# EAGLE design 8x8 led matrix DRIVER (EAGLE 7.5.0)
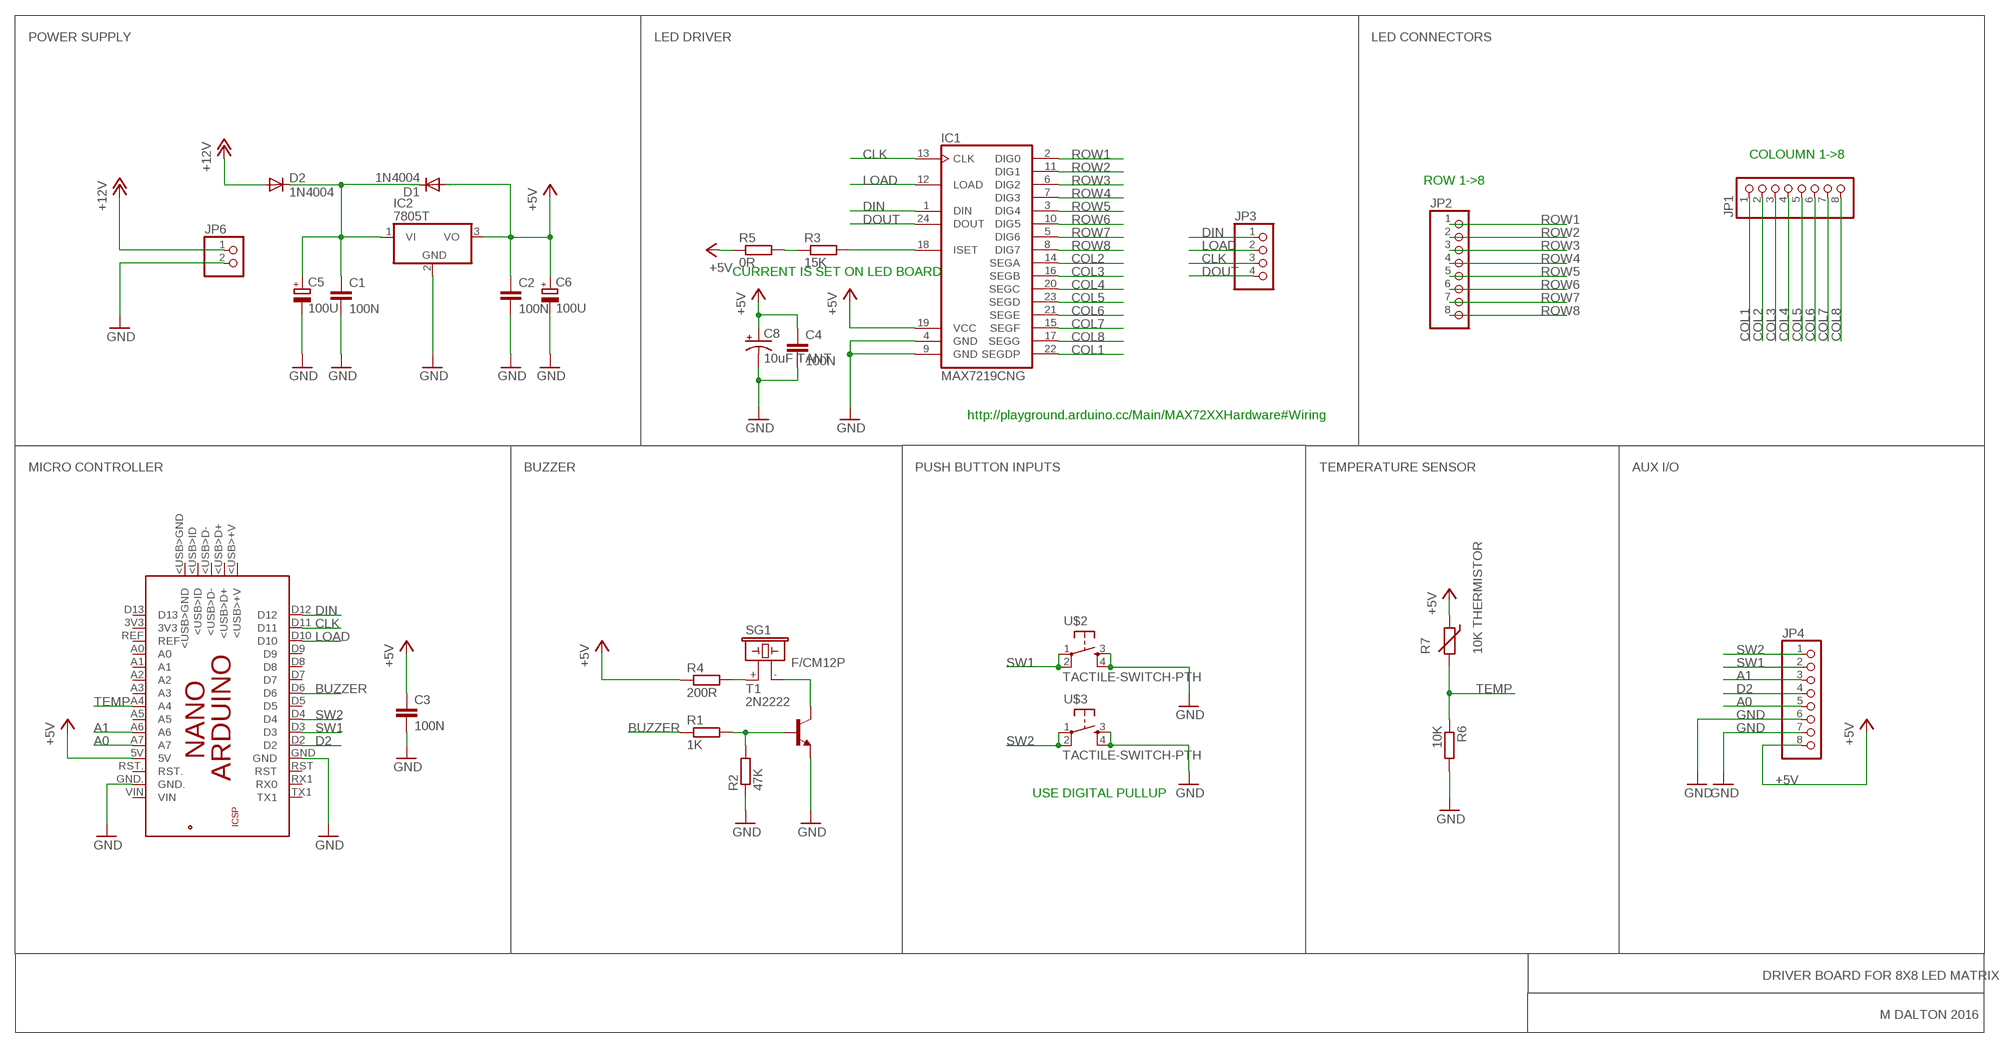
[diagram p0: schematic, sheet 1]

## Parts
C1  100N  C-EUC1206K  [C1206K]
C2  100N  C-EUC1206K  [C1206K]
C3  100N  C-EUC1206K  [C1206K]
C4  100N  C-EUC1206K  [C1206K]
C5  100U  CPOL-EUE5-10.5  [E5-10,5]
C6  100U  CPOL-EUE5-10.5  [E5-10,5]
C8  10uF TANT  10UF-TANT  [EIA3216]
D1  1N4004  [DO41-10]
D2  1N4004  [DO41-10]
IC1  MAX7219CNG  [DIL24-3]
IC2  7805T  [TO220H]
JP1  PINHD-1X8  [1X08]
JP2  PINHD-1X8  [1X08]
JP3  PINHD-1X4  [1X04]
JP4  PINHD-1X8  [1X08]
JP6  PINHD-1X2  [1X02]
PCB1  ARDUINO_NANO  [ARDUINO_NANO]
R1  1K  R-EU_M1206  [M1206]
R2  47K  R-EU_M1206  [M1206]
R3  15K  R-EU_M0805  [M0805]
R4  200R  R-EU_M1206  [M1206]
R5  0R  R-EU_M0805  [M0805]
R6  10K  R-EU_M1206  [M1206]
R7  10K THERMISTOR  THERMISTOR-7,5  [R-7,5]
SG1  F/CM12P  [F/CM12P]
T1  2N2222  [TO92-EBC-OVAL]
U$2  TACTILE-SWITCH-PTH  [TAC-SWITCH-PTH]
U$3  TACTILE-SWITCH-PTH  [TAC-SWITCH-PTH]

## Nets
+5V: C2.1 C3.1 C4.1 C6.+ C8.A(+) D1.A IC1.19(VCC) IC2.3(VO) JP4.8 PCB1.5V R4.1 R5.1 R7.1
+12V: D2.A JP6.1
A0: JP4.5 PCB1.A7
A1: JP4.3 PCB1.A6
BUZZER: PCB1.D6 R1.1
CLK: IC1.13(CLK) JP3.3 PCB1.D11
COL1: IC1.22(SEGDP) JP1.1
COL2: IC1.14(SEGA) JP1.2
COL3: IC1.16(SEGB) JP1.3
COL4: IC1.20(SEGC) JP1.4
COL5: IC1.23(SEGD) JP1.5
COL6: IC1.21(SEGE) JP1.6
COL7: IC1.15(SEGF) JP1.7
COL8: IC1.17(SEGG) JP1.8
D2: JP4.4 PCB1.D2
DIN: IC1.1(DIN) JP3.1 PCB1.D12
DOUT: IC1.24(DOUT) JP3.4
GND: C1.2 C2.2 C3.2 C4.2 C5.- C6.- C8.C(-) IC1.4(GND) IC1.9(GND) IC2.2(GND) JP4.6 JP4.7 JP6.2 PCB1.GND PCB1.GND. R2.1 R6.2 T1.E U$2.3 U$2.4 U$3.3 U$3.4
LOAD: IC1.12(LOAD) JP3.2 PCB1.D10
N$1: R3.1 R5.2
N$8: C1.1 C5.+ D1.C D2.C IC2.1(VI)
N$22: IC1.18(ISET) R3.2
N$27: R1.2 R2.2 T1.B
N$29: SG1.- T1.C
N$30: R4.2 SG1.+
ROW1: IC1.2(DIG0) JP2.1
ROW2: IC1.11(DIG1) JP2.2
ROW3: IC1.6(DIG2) JP2.3
ROW4: IC1.7(DIG3) JP2.4
ROW5: IC1.3(DIG4) JP2.5
ROW6: IC1.10(DIG5) JP2.6
ROW7: IC1.5(DIG6) JP2.7
ROW8: IC1.8(DIG7) JP2.8
SW1: JP4.2 PCB1.D3 U$2.1 U$2.2
SW2: JP4.1 PCB1.D4 U$3.1 U$3.2
TEMP: PCB1.A4 R6.1 R7.2
Unconnected: PCB1.3V3 PCB1.5V. PCB1.<USB>+V PCB1.<USB>D+ PCB1.<USB>D- PCB1.<USB>GND PCB1.<USB>ID PCB1.A0 PCB1.A1 PCB1.A2 PCB1.A3 PCB1.A5 PCB1.D5 PCB1.D7 PCB1.D8 PCB1.D9 PCB1.D13 PCB1.GND_ PCB1.MISO PCB1.MOSI PCB1.REF PCB1.RESET.. PCB1.RST PCB1.RST. PCB1.RX1(RX0) PCB1.SCK PCB1.TX1 PCB1.VIN

## Notes on the sheet
- POWER SUPPLY | LED DRIVER | LED CONNECTORS
- COLOUMN 1->8
- ROW 1->8
- CURRENT IS SET ON LED BOARD
- http://playground.arduino.cc/Main/MAX72XXHardware#Wiring
- MICRO CONTROLLER | BUZZER | PUSH BUTTON INPUTS | TEMPERATURE SENSOR | AUX I/O
- USE DIGITAL PULLUP
- DRIVER BOARD FOR 8X8 LED MATRIX
- M DALTON 2016

## Library data of the parts
C1-C4 = rcl:C-EU: CAPACITOR, European symbol
C5 C6 = rcl:CPOL-EU: POLARIZED CAPACITOR, European symbol
C8 = SparkFun-Retired:10UF-TANT: 10uF Tantalum SMT CAP-00811- 16V 10% (EIA-3216); PROD_ID: CAP-00811; VALUE: 10uF
D1 = diode:1N4004: DIODE
D2 = adafruit:1N4004: DIODE
IC1 = maxim:MAX7219CNG: LED DISPLAY DRIVER; MF: MAXIM; MPN: MAX7219CNG; OC_FARNELL: 1523914; OC_NEWARK: 34C4018
IC2 = adafruit:78*: Positive VOLTAGE REGULATOR Added bigger pads to the TO-92 package
JP1 JP2 JP4 = pinhead:PINHD-1X8: PIN HEADER
JP3 = pinhead:PINHD-1X4: PIN HEADER
JP6 = pinhead:PINHD-1X2: PIN HEADER
PCB1 = E14_Arduino_published:ARDUINO_NANO: Device for representing an Arduino Nano board with a footprint in an EAGLE design. Created by Dave Young for Element14. More EAGLE documentation at: http://www.element14.com/community/community/knode/cadsoft_eagle
R1-R6 = rcl:R-EU_: RESISTOR, European symbol
R7 = varistor:THERMISTOR: THERMISTOR
SG1 = buzzer:F/CM12P: BUZZER Source: Buerklin; OC_FARNELL: unknown; OC_NEWARK: unknown
T1 = adafruit:2N2222: NPN TRANSISTOR Big oval pads
U$2 U$3 = GeekAmmo:TACTILE-SWITCH: Tactile Switch 4 Pins, SPST NO

## Board
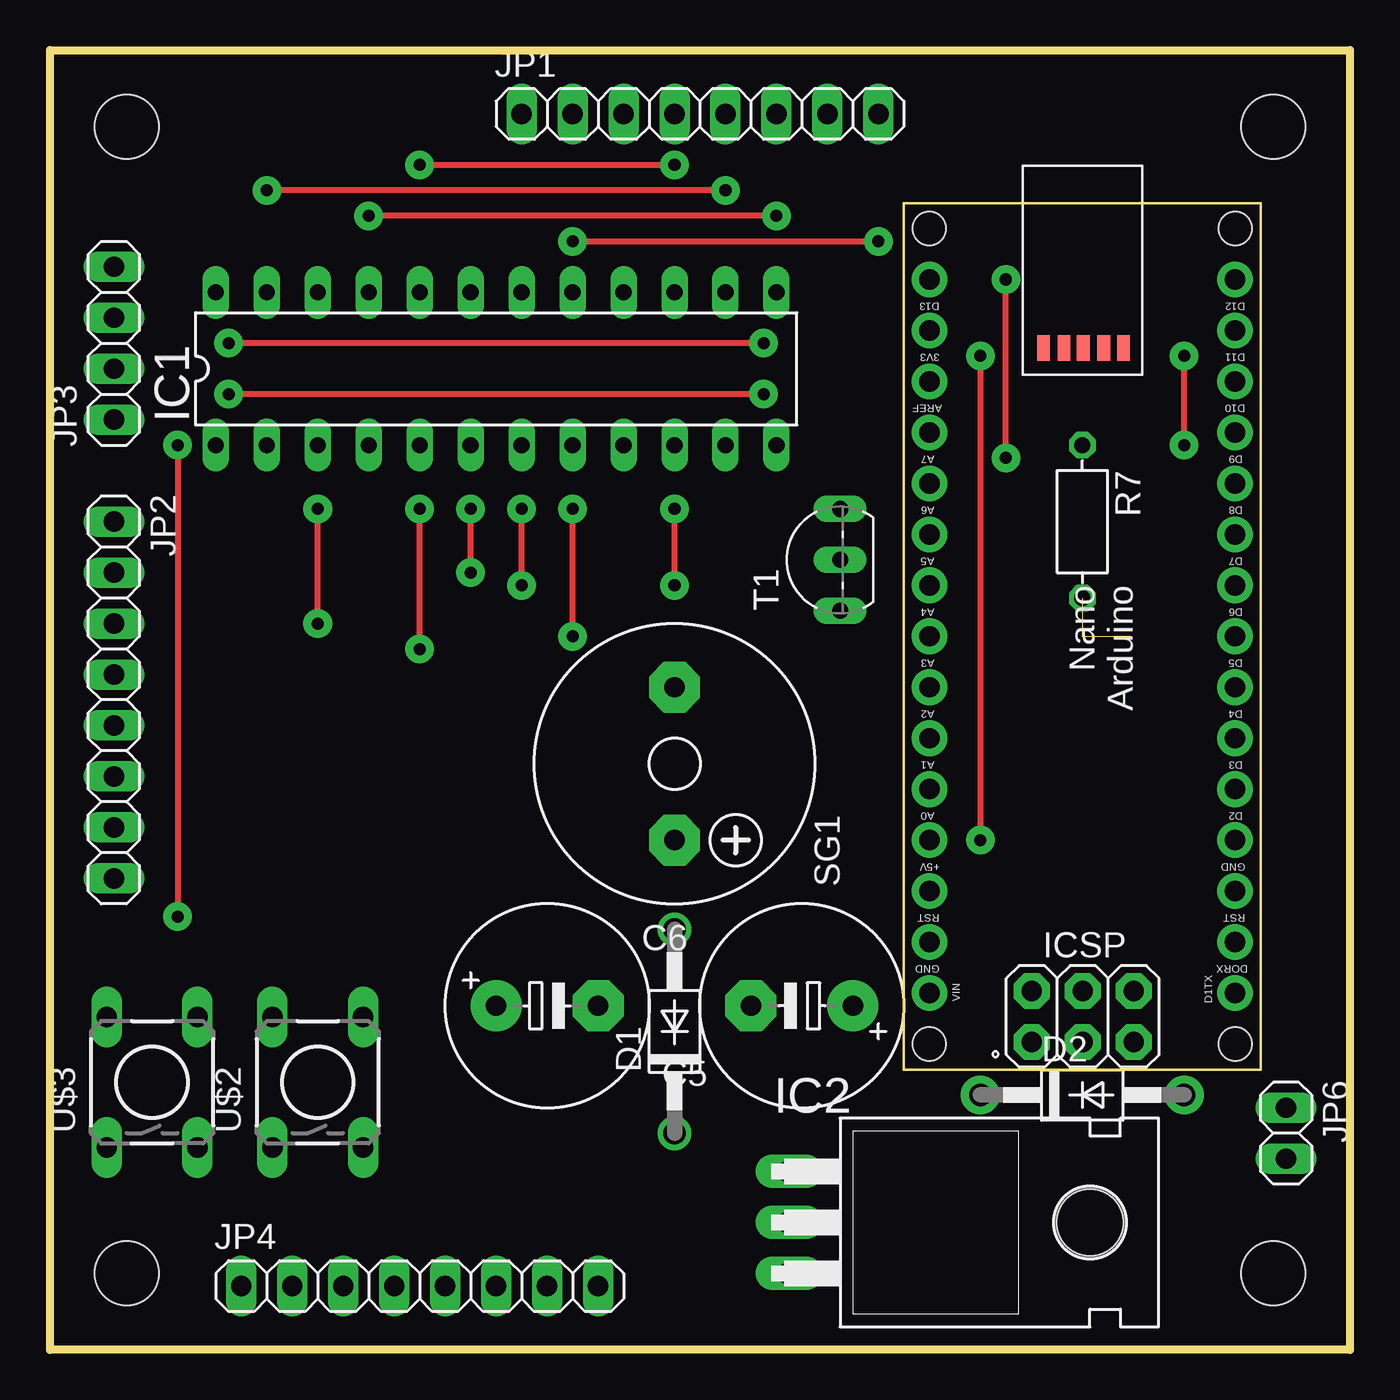
[diagram p1: board, top side]
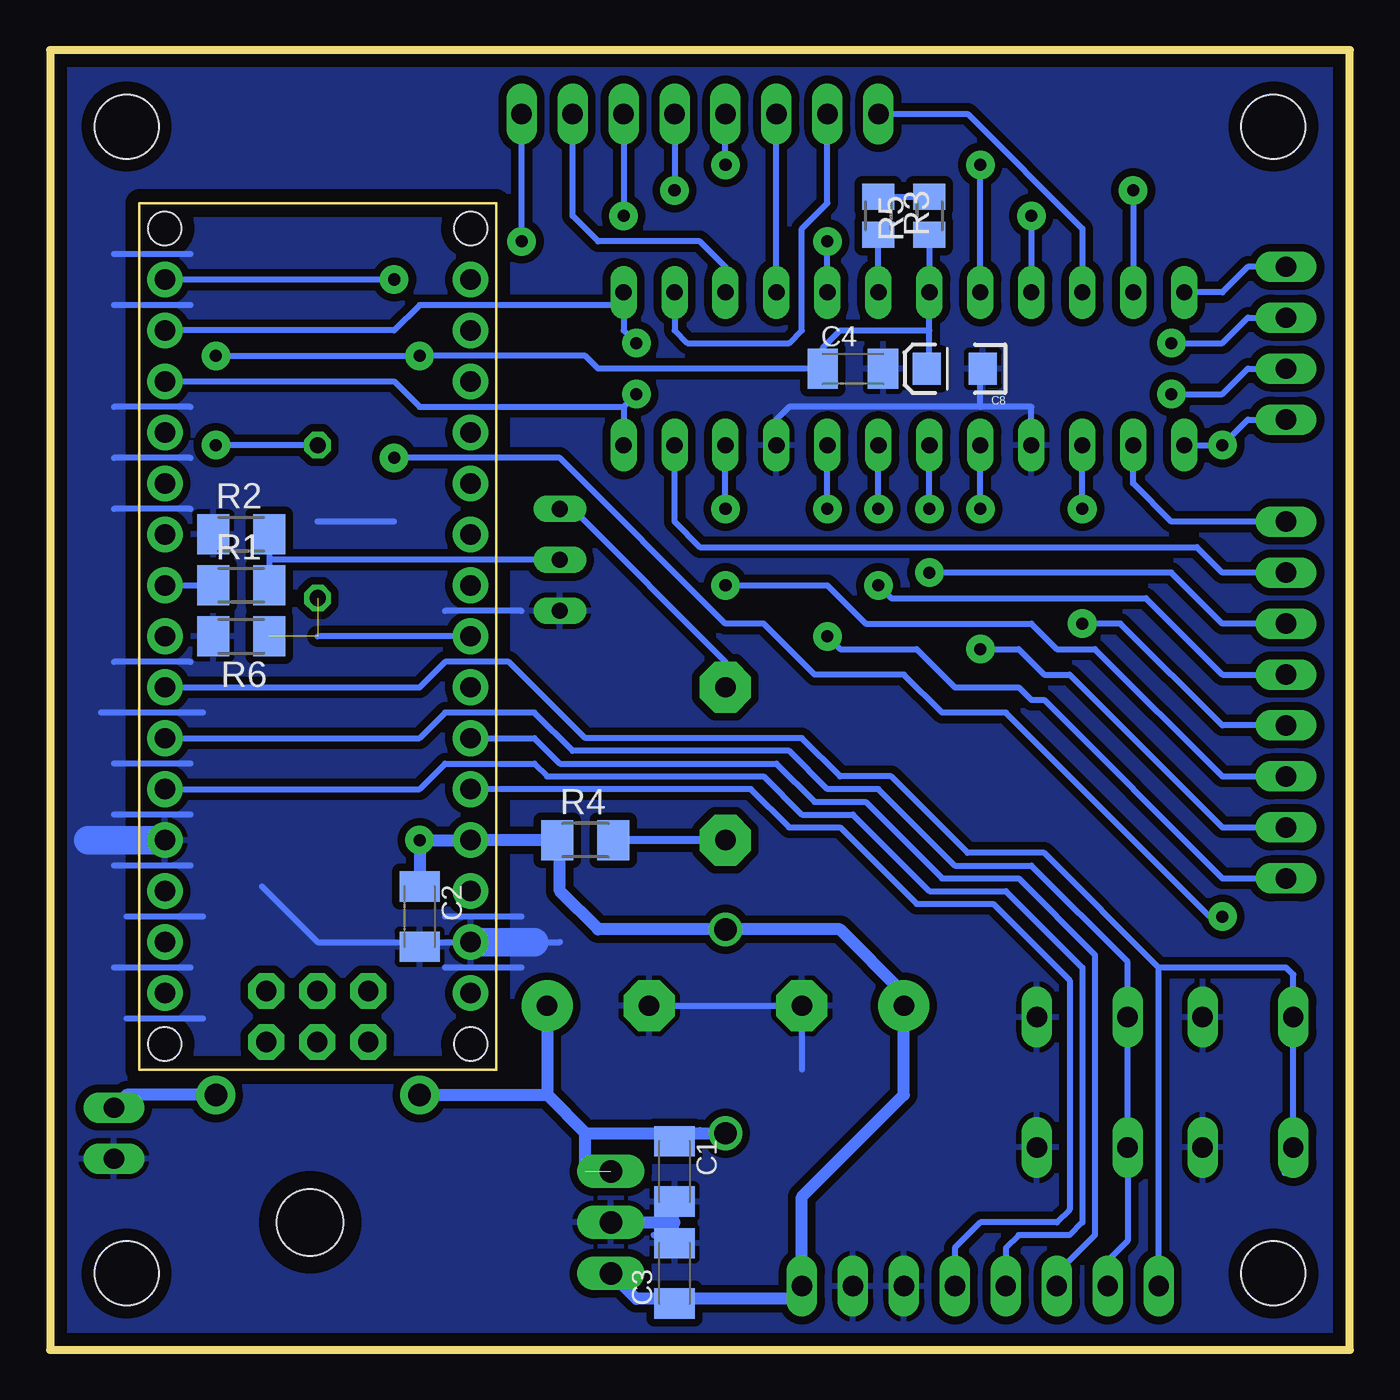
[diagram p2: board, bottom side, seen from below]

Size 64.77 x 64.77 mm. Coordinates in mm from the lower left corner, seen from the top.
Outline: 64.77,0 0,0 0,64.77 64.77,64.77 64.77,0
Copper layers (1*16): Top 0.035mm / dielectric 1.5mm / Bottom 0.035mm
Design rules "default *": minimum track width 10mil, minimum drill 24mil, track to track 15mil, track to pad 15mil, pad to pad 15mil, via to via 15mil, smd to smd 15mil, copper to edge 25mil, drill to drill 10mil, minimum pad ring 10mil, minimum via ring 8mil, stop-mask expansion 4mil, vias tented up to drill 0mil, thermal gap 10mil
Holes 3.2 mm at 3.81,3.81 60.96,3.81 3.81,60.96 60.96,60.96

### Footprints (pad centres in the part's own frame; a part is rotated, then mirrored left to right if it is on the bottom)
C1206K = smd 1.5 x 2: 1 -1.5,0; 2 1.5,0
E5-10,5 = drill 1.016 pad 2.54: + -2.54,0 | drill 1.016 pad 2.54 octagon: - 2.54,0
EIA3216 = smd 1.4 x 1.6: A 1.4,0; C -1.4,0
DO41-10 = drill 1.118: A 5.08,0; C -5.08,0
DO41-10' = drill 1.118 pad 1.93: A 5.08,0; C -5.08,0
DIL24-3 = drill 0.813 long: 1 -13.97,-3.81; 2 -11.43,-3.81; 3 -8.89,-3.81; 4 -6.35,-3.81; 5 -3.81,-3.81; 6 -1.27,-3.81; 7 1.27,-3.81; 8 3.81,-3.81; 9 6.35,-3.81; 10 8.89,-3.81; 11 11.43,-3.81; 12 13.97,-3.81; 13 13.97,3.81; 14 11.43,3.81; 15 8.89,3.81; 16 6.35,3.81; 17 3.81,3.81; 18 1.27,3.81; 19 -1.27,3.81; 20 -3.81,3.81; 21 -6.35,3.81; 22 -8.89,3.81; 23 -11.43,3.81; 24 -13.97,3.81
TO220H = drill 1.118 long: 1 -2.54,-10.16; 2 0,-10.16; 3 2.54,-10.16 | hole 3.302: 0,4.826
1X08 = drill 1.016 long: 1 -8.89,0; 2 -6.35,0; 3 -3.81,0; 4 -1.27,0; 5 1.27,0; 6 3.81,0; 7 6.35,0; 8 8.89,0
1X04 = drill 1.016 long: 1 -3.81,0; 2 -1.27,0; 3 1.27,0; 4 3.81,0
1X02 = drill 1.016 long: 1 -1.27,0; 2 1.27,0
ARDUINO_NANO = drill 1.016 pad 1.778: 3V3 6.35,1.27; 5V 31.75,1.27; A0 11.43,1.27; A1 13.97,1.27; A2 16.51,1.27; A3 19.05,1.27; A4 21.59,1.27; A5 24.13,1.27; A6 26.67,1.27; A7 29.21,1.27; D2 29.21,16.51; D3 26.67,16.51; D4 24.13,16.51; D5 21.59,16.51; D6 19.05,16.51; D7 16.51,16.51; D8 13.97,16.51; D9 11.43,16.51; D10 8.89,16.51; D11 6.35,16.51; D12 3.81,16.51; D13 3.81,1.27; GND 31.75,16.51; GND. 36.83,1.27; REF 8.89,1.27; RST 34.29,16.51; RST. 34.29,1.27; RX1 36.83,16.51; TX1 39.37,16.51; VIN 39.37,1.27 | drill 1.016 pad 1.778 octagon: 5V. 39.268,6.375; GND_ 39.268,11.455; MISO 41.808,6.375; MOSI 39.268,8.915; RESET.. 41.808,11.455; SCK 41.808,8.915 | smd 1.27 x 0.635: <USB>+V 7.214,10.947; <USB>D+ 7.214,9.957; <USB>D- 7.214,8.941; <USB>GND 7.214,6.96; <USB>ID 7.214,7.976 | hole 1.651: 1.27,1.27; 1.27,16.51; 41.91,16.51; 41.91,1.27
M1206 = smd 1.6 x 2: 1 -1.4,0; 2 1.4,0
M0805 = smd 1.3 x 1.6: 1 -0.95,0; 2 0.95,0
R-7,5 = drill 0.813 octagon: 1 -3.81,0; 2 3.81,0
F/CM12P = drill 1.016 pad 2.54 octagon: + 3.81,0; - -3.81,0
TO92-EBC-OVAL = drill 0.813 long: B 0,-1.27; C 2.54,-1.27; E -2.54,-1.27
TAC-SWITCH-PTH = drill 1.016 pad 1.524 long: 1 -3.251,2.261; 2 3.251,2.261; 3 -3.251,-2.261; 4 3.251,-2.261

### Placement (x,y rotation side)
C1  33.66,8.89 270 bottom
C2  46.36,21.59 270 bottom
C3  33.66,3.81 90 bottom
C4  24.77,48.9 0 bottom
C5  37.47,17.14 180 top
C6  24.77,17.14 0 top
C8  19.69,48.9 180 bottom
D1  31.12,15.88 90 top
D2  1N4004  [DO41-10']  51.44,12.7 0 top
IC1  22.23,48.9 0 top
IC2  46.99,6.35 270 top
JP1  32.38,61.6 0 top
JP2  3.17,32.38 270 top
JP3  3.17,50.16 90 top
JP4  18.41,3.18 0 top
JP6  61.59,10.8 270 top
PCB1  42.55,57.15 270 top
R1  55.25,38.1 0 bottom
R2  55.25,40.64 0 bottom
R3  23.5,56.51 270 bottom
R4  38.1,25.4 0 bottom
R5  20.95,56.51 90 bottom
R6  55.25,35.56 180 bottom
R7  51.44,41.27 270 top
SG1  31.12,29.21 270 top
T1  38.1,39.37 90 top
U$2  13.33,13.34 90 top
U$3  5.08,13.34 90 top

### Tracks (layer width: path | path; a pad name or v marks a point on that pad's centre or on a via)
+5V  (via drill 0.6 pad 1.42)
  Top 0.305: v46.36,49.53 v46.36,25.4 | v56.52,45.09 v56.52,49.53
  Bottom 0.305: 39.37,25.4 R4.1 | R5.1 IC1.19 20.95,50.8 | R7.1 v56.52,45.09 | v56.52,49.53 v46.36,49.53 38.1,49.53 37.47,48.9 C4.1 26.27,49.94 25.4,50.8 20.95,50.8 | C8.A 21.09,49.02 20.95,48.9 20.95,50.8
  Bottom 0.406: 33.66,2.54 34.52,2.54 C3.1
  Bottom 0.61: C2.1 v46.36,25.4 PCB1.5V 39.37,25.4 39.37,22.86 37.47,20.95 D1.A 25.4,20.95 22.23,17.78 C6.+ 22.23,12.7 27.3,7.62 JP4.8 27.3,2.54 33.66,2.54 | 34.52,2.54 35.56,2.54 IC2.3
+12V
  Bottom 0.61: D2.A 60.96,12.7 JP6.1
A0
  Bottom 0.305: JP4.5 19.69,5.08 18.41,6.35 14.6,6.35 13.97,6.98 13.97,18.41 17.78,22.23 21.59,22.23 25.4,26.04 27.94,26.04 29.84,27.94 PCB1.A7
A1
  Bottom 0.305: JP4.3 14.6,3.81 12.7,5.71 12.7,19.68 16.51,23.49 20.32,23.49 24.13,27.3 26.67,27.3 28.58,29.21 39.37,29.21 40.64,30.48 PCB1.A6
BUZZER
  Bottom 0.305: PCB1.D6 R1.1
CLK  (via drill 0.6 pad 1.42)
  Top 0.305: v35.56,50.16 v8.89,50.16
  Bottom 0.305: PCB1.D11 47.62,50.8 46.36,52.07 36.2,52.07 IC1.13 36.2,50.8 v35.56,50.16 | v8.89,50.16 6.35,50.16 5.08,51.44 JP3.3
COL1
  Bottom 0.305: JP1.1 19.05,61.6 13.33,55.88 IC1.22
COL2
  Bottom 0.305: IC1.14 33.66,50.8 33.02,50.16 27.94,50.16 27.3,50.8 27.3,55.88 26.04,57.15 JP1.2
COL3
  Bottom 0.305: IC1.16 JP1.3
COL4  (via drill 0.6 pad 1.42)
  Top 0.305: v18.41,59.05 v31.12,59.05
  Bottom 0.305: IC1.20 v18.41,59.05 | v31.12,59.05 JP1.4
COL5  (via drill 0.6 pad 1.42)
  Top 0.305: v33.66,57.79 v10.79,57.79
  Bottom 0.305: JP1.5 v33.66,57.79 | v10.79,57.79 IC1.23
COL6  (via drill 0.6 pad 1.42)
  Top 0.305: v36.2,56.51 v15.87,56.51
  Bottom 0.305: JP1.6 v36.2,56.51 | v15.87,56.51 IC1.21
COL7
  Bottom 0.305: IC1.15 31.12,53.98 32.38,55.24 37.47,55.24 38.73,56.51 JP1.7
COL8  (via drill 0.6 pad 1.42)
  Top 0.305: v26.04,55.24 v41.27,55.24
  Bottom 0.305: IC1.17 v26.04,55.24 | v41.27,55.24 JP1.8
D2
  Bottom 0.305: JP4.4 17.14,5.08 16.51,5.71 13.97,5.71 13.33,6.35 13.33,19.05 17.14,22.86 20.95,22.86 24.77,26.67 27.3,26.67 29.21,28.58 40.01,28.58 40.64,29.21 45.09,29.21 46.36,27.94 PCB1.D2
DIN  (via drill 0.6 pad 1.42)
  Top 0.305: v6.35,45.09 v6.35,21.59 | v47.62,44.45 v47.62,53.34
  Bottom 0.305: IC1.1 v6.35,45.09 5.08,46.35 JP3.1 | v47.62,44.45 39.37,44.45 31.12,36.2 29.21,36.2 26.67,33.66 22.23,33.66 20.32,31.75 17.14,31.75 6.98,21.59 v6.35,21.59 | v47.62,53.34 PCB1.D12
DOUT
  Bottom 0.305: JP3.4 5.08,53.98 6.35,52.71 IC1.24
GND
  Bottom 0.305: 18.41,46.99 15.87,46.99 IC1.4 | 18.41,46.99 27.94,46.99 28.58,46.35 IC1.9 | 18.41,46.99 18.41,48.66 | 34.7,5.71 C3.2 | C5.- C6.- 27.3,13.97 | 40.64,20.32 39.37,20.32 | 54.2,23.09 51.44,20.32 PCB1.GND. | 47.62,41.27 51.44,41.27 | 57.78,46.99 61.59,46.99 | 57.78,44.45 61.59,44.45 | 57.78,41.91 61.59,41.91 | 57.78,26.67 61.59,26.67 | 57.78,24.13 61.59,24.13 | 57.15,21.59 60.96,21.59 | 57.78,19.05 61.59,19.05 | 57.15,16.51 60.96,16.51 | 41.27,21.59 45.09,21.59 | 41.27,19.05 45.09,19.05 | 41.27,36.83 45.09,36.83 | 57.78,29.21 61.59,29.21 | 57.15,31.75 62.23,31.75 | 57.78,34.29 61.59,34.29 | 57.78,52.07 61.59,52.07 | 57.78,54.61 61.59,54.61
  Bottom 0.406: C1.2 33.66,6.35 C3.2
  Bottom 0.61: IC2.2 33.66,6.35
  Bottom 1.422: PCB1.GND. 40.64,20.32 | PCB1.GND 62.86,25.4
  pour Bottom: -0.63,65.41 -0.63,-0.63 66.04,-0.63 66.04,65.41
LOAD  (via drill 0.6 pad 1.42)
  Top 0.305: v35.56,47.62 v8.89,47.62
  Bottom 0.305: PCB1.D10 47.62,48.26 46.36,46.99 36.2,46.99 | 36.2,46.99 IC1.12 | 36.2,46.99 v35.56,47.62 | v8.89,47.62 6.35,47.62 5.08,48.9 JP3.2
N$1
  Bottom 0.305: R3.1 R5.2
N$8  (1 unrouted)
  Bottom 0.305: D1.C 32.38,10.8
  Bottom 0.406: 32.38,10.8 34.7,10.8 C1.1
  Bottom 0.61: C5.+ 40.01,12.7 | 40.01,12.7 38.1,10.8 | 38.1,8.89 38.1,10.8 | 38.1,10.8 32.38,10.8 31.75,10.8 | D2.C 40.01,12.7
N$22
  Bottom 0.305: IC1.18 R3.2
N$27
  Bottom 0.305: T1.B 53.84,39.37 | R2.2 53.84,39.37 | 53.84,39.37 R1.2
N$29
  Bottom 0.305: T1.C 38.73,41.91 31.12,34.29 SG1.-
N$30
  Bottom 0.406: SG1.+ R4.2
ROW1
  Bottom 0.305: JP2.1 8.89,41.27 10.79,43.18 IC1.2
ROW2
  Bottom 0.305: JP2.2 6.35,38.73 7.62,40.01 32.38,40.01 33.66,41.27 IC1.11
ROW3  (via drill 0.6 pad 1.42)
  Top 0.305: v20.95,38.73 v20.95,41.91
  Bottom 0.305: JP2.3 6.35,36.2 8.89,38.73 v20.95,38.73 | v20.95,41.91 IC1.6
ROW4  (via drill 0.6 pad 1.42)
  Top 0.305: v23.5,38.1 v23.5,41.91
  Bottom 0.305: v23.5,41.91 IC1.7 | v23.5,38.1 22.86,37.47 10.16,37.47 6.35,33.66 JP2.4
ROW5  (via drill 0.6 pad 1.42)
  Top 0.305: v13.33,36.2 v13.33,41.91
  Bottom 0.305: v13.33,41.91 IC1.3 | JP2.5 6.35,31.12 11.43,36.2 v13.33,36.2
ROW6  (via drill 0.6 pad 1.42)
  Top 0.305: v31.12,38.1 v31.12,41.91
  Bottom 0.305: v31.12,41.91 IC1.10 | v31.12,38.1 26.04,38.1 24.13,36.2 15.87,36.2 14.6,34.92 12.7,34.92 6.35,28.58 JP2.6
ROW7  (via drill 0.6 pad 1.42)
  Top 0.305: v18.41,34.92 v18.41,41.91
  Bottom 0.305: v18.41,41.91 IC1.5 | v18.41,34.92 16.51,34.92 15.24,33.66 13.97,33.66 6.35,26.04 JP2.7
ROW8  (via drill 0.6 pad 1.42)
  Top 0.305: v26.04,35.56 v26.04,41.91
  Bottom 0.305: v26.04,41.91 IC1.8 | v26.04,35.56 25.4,34.92 21.59,34.92 19.69,33.02 16.51,33.02 15.87,32.38 15.24,32.38 6.35,23.49 JP2.8
SW1
  Bottom 0.305: JP4.2 12.06,4.45 11.07,5.44 U$2.1 U$2.2 11.07,19.33 15.87,24.13 19.69,24.13 23.5,27.94 26.04,27.94 27.94,29.84 38.73,29.84 40.64,31.75 45.09,31.75 46.36,30.48 PCB1.D3
SW2
  Bottom 0.305: 3.25,8.81 U$3.1 U$3.2 2.82,18.69 3.17,19.05 9.53,19.05 | 9.53,19.05 15.24,24.77 19.05,24.77 22.86,28.58 25.4,28.58 27.3,30.48 38.1,30.48 41.91,34.29 45.09,34.29 46.36,33.02 PCB1.D4 | JP4.1 9.53,19.05
TEMP  (2 unrouted)
  Bottom 0.305: PCB1.A4 51.44,35.56